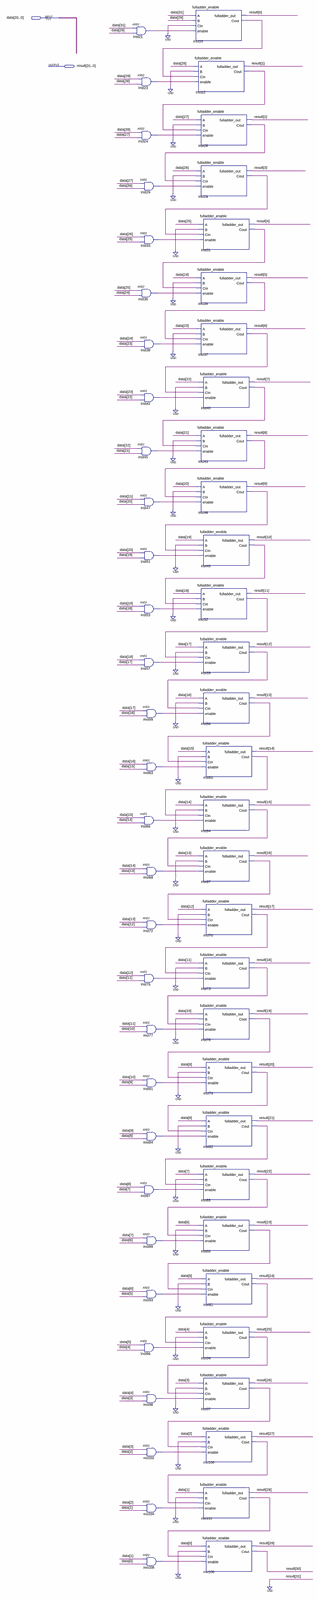
[diagram p0: schematic sheet, whole]
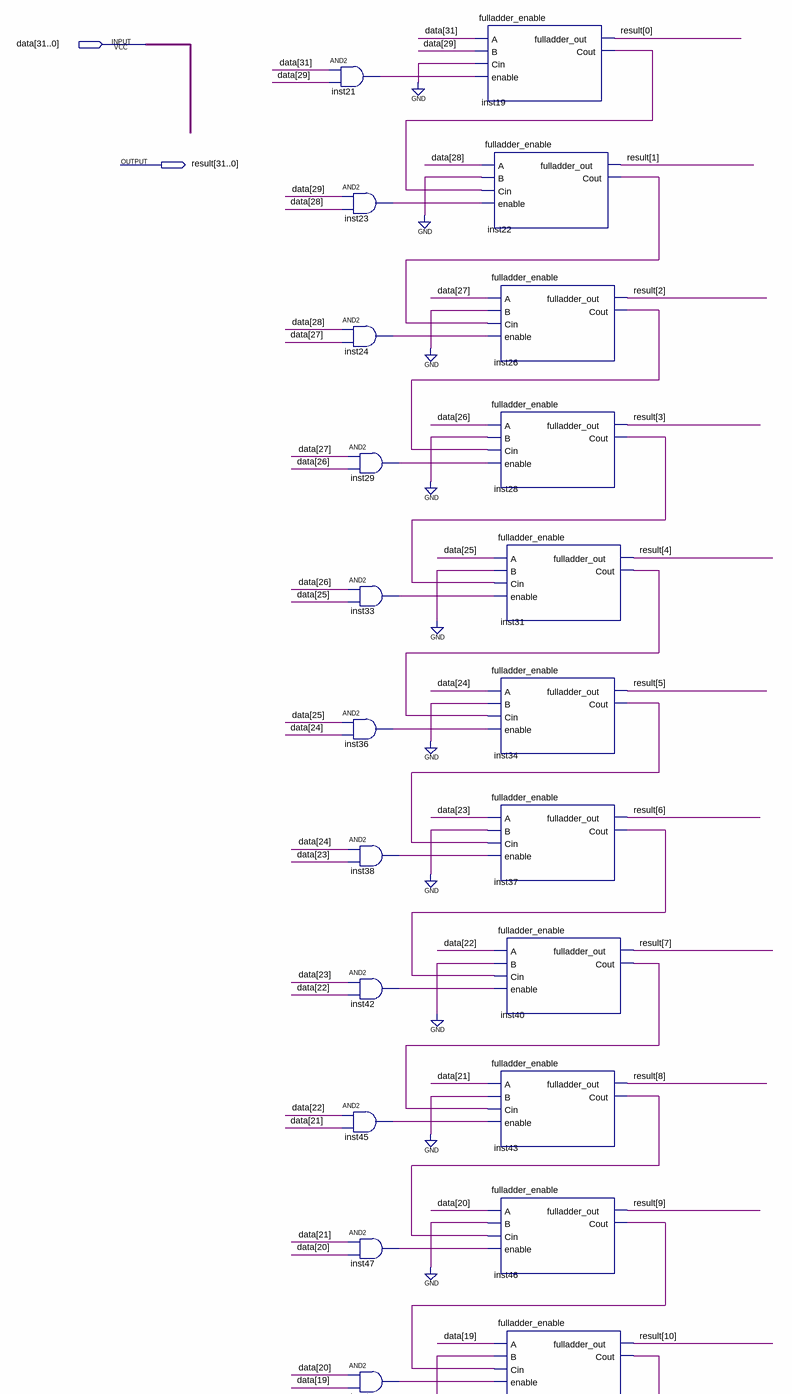
[diagram p1: schematic sheet, upper part]
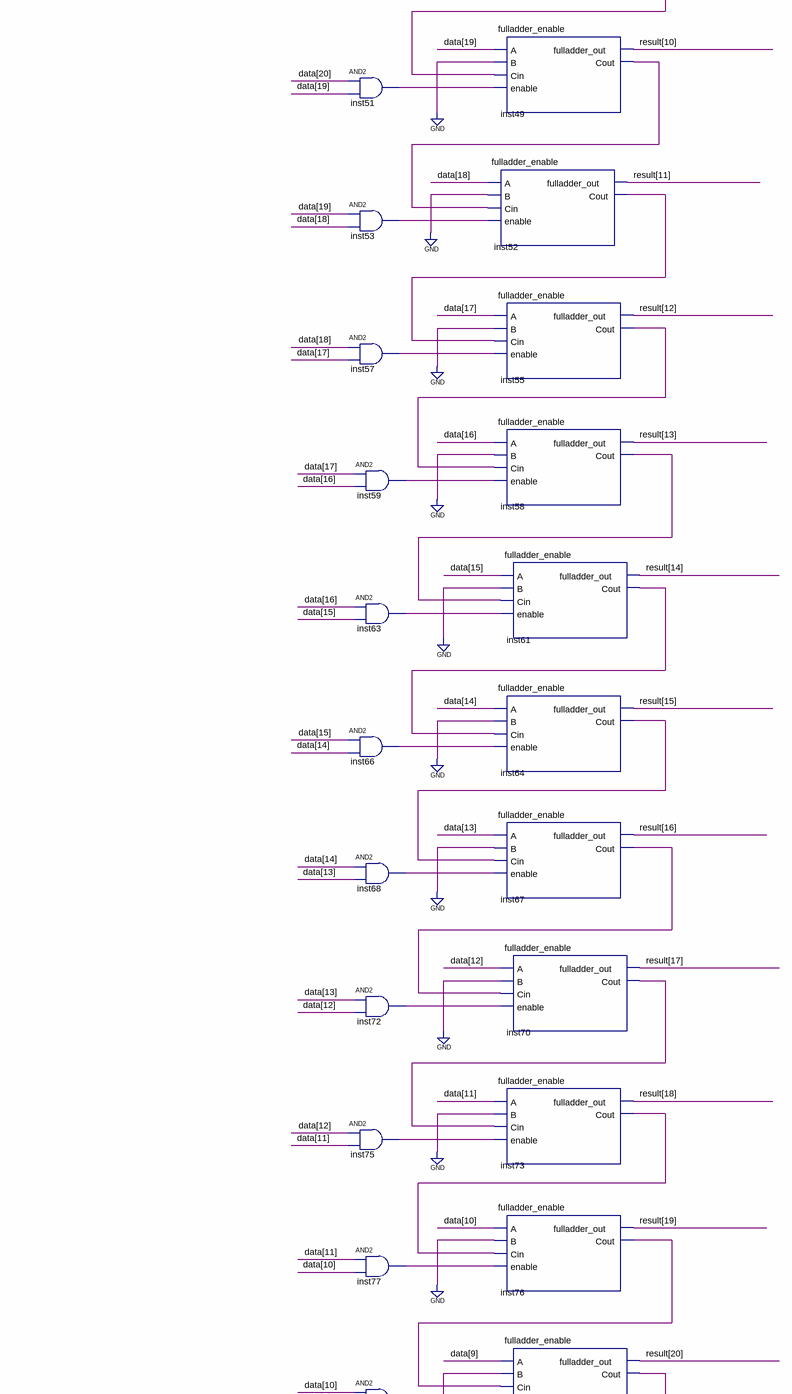
[diagram p2: schematic sheet, middle part]
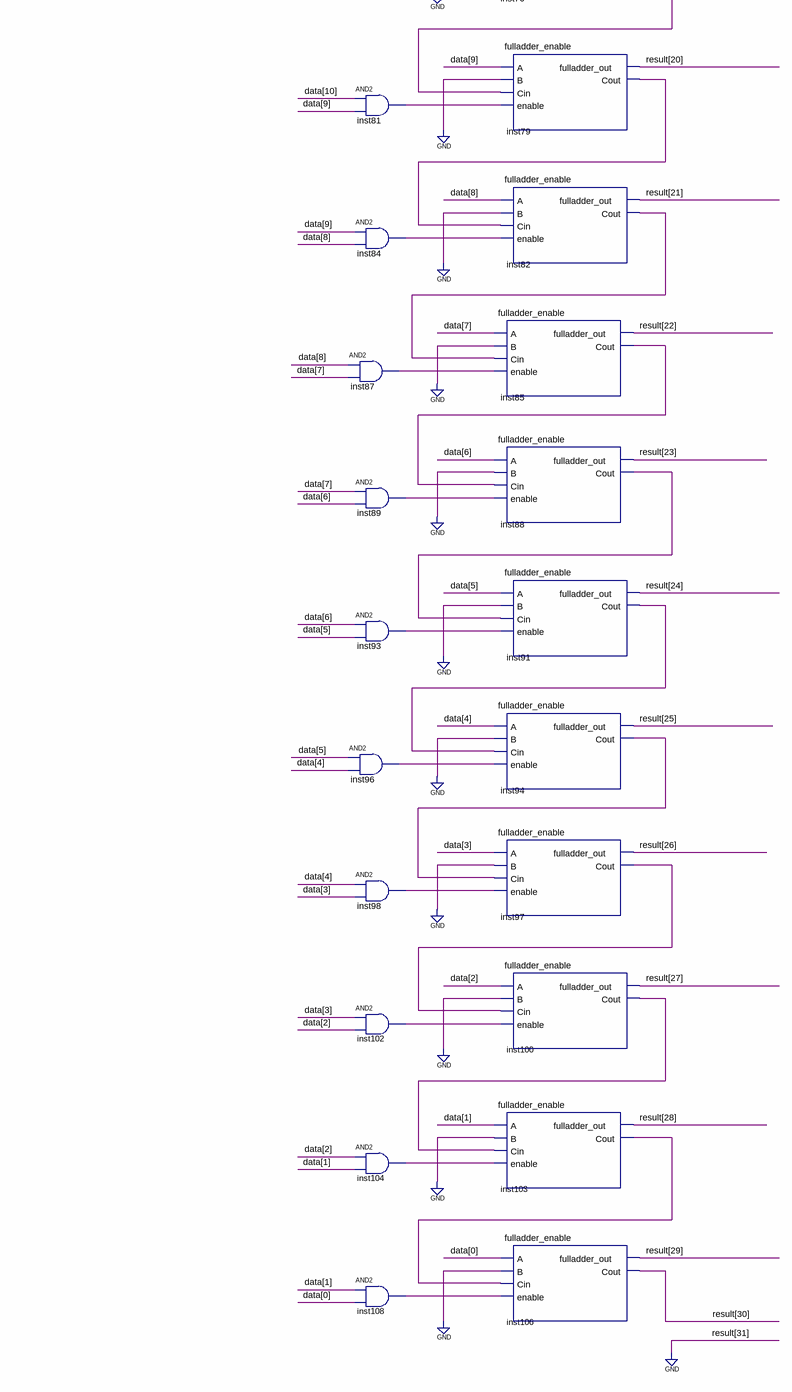
[diagram p3: schematic sheet, lower part]
// Quartus schematic clo_instruction.bdf as structural Verilog: 60 symbols, 2 pins
module clo_instruction (
  input  [31:0] data,
  output [31:0] result
);

  wire inst19_cout, inst21_out, inst22_cout, inst23_out, inst24_out, inst26_cout, inst28_cout, inst29_out,
       inst31_cout, inst33_out, inst34_cout, inst36_out, inst37_cout, inst38_out, inst40_cout, inst42_out,
       inst43_cout, inst45_out, inst46_cout, inst47_out, inst49_cout, inst51_out, inst52_cout, inst53_out,
       inst55_cout, inst57_out, inst58_cout, inst59_out, inst61_cout, inst63_out, inst64_cout, inst66_out,
       inst67_cout, inst68_out, inst70_cout, inst72_out, inst73_cout, inst75_out, inst76_cout, inst77_out,
       inst79_cout, inst81_out, inst82_cout, inst84_out, inst85_cout, inst87_out, inst88_cout, inst89_out,
       inst91_cout, inst93_out, inst94_cout, inst96_out, inst97_cout, inst98_out, inst100_cout, inst102_out,
       inst103_cout, inst104_out, inst108_out;

  and inst21 (inst21_out, data[31], data[29]);
  and inst23 (inst23_out, data[29], data[28]);
  and inst24 (inst24_out, data[28], data[27]);
  and inst29 (inst29_out, data[27], data[26]);
  and inst33 (inst33_out, data[26], data[25]);
  and inst36 (inst36_out, data[25], data[24]);
  and inst38 (inst38_out, data[24], data[23]);
  and inst42 (inst42_out, data[23], data[22]);
  and inst45 (inst45_out, data[22], data[21]);
  and inst47 (inst47_out, data[21], data[20]);
  and inst51 (inst51_out, data[20], data[19]);
  and inst53 (inst53_out, data[19], data[18]);
  and inst57 (inst57_out, data[18], data[17]);
  and inst59 (inst59_out, data[17], data[16]);
  and inst63 (inst63_out, data[16], data[15]);
  and inst66 (inst66_out, data[15], data[14]);
  and inst68 (inst68_out, data[14], data[13]);
  and inst72 (inst72_out, data[13], data[12]);
  and inst75 (inst75_out, data[12], data[11]);
  and inst77 (inst77_out, data[11], data[10]);
  and inst81 (inst81_out, data[10], data[9]);
  and inst84 (inst84_out, data[9], data[8]);
  and inst87 (inst87_out, data[8], data[7]);
  and inst89 (inst89_out, data[7], data[6]);
  and inst93 (inst93_out, data[6], data[5]);
  and inst96 (inst96_out, data[5], data[4]);
  and inst98 (inst98_out, data[4], data[3]);
  and inst102 (inst102_out, data[3], data[2]);
  and inst104 (inst104_out, data[2], data[1]);
  and inst108 (inst108_out, data[1], data[0]);
  fulladder_enable inst19 (
    .A(data[31]), .B(data[29]), .Cin(1'b0), .enable(inst21_out), .fulladder_out(result[0]), .Cout(inst19_cout));
  fulladder_enable inst22 (
    .A(data[28]), .B(1'b0), .Cin(inst19_cout), .enable(inst23_out), .fulladder_out(result[1]),
    .Cout(inst22_cout));
  fulladder_enable inst26 (
    .A(data[27]), .B(1'b0), .Cin(inst22_cout), .enable(inst24_out), .fulladder_out(result[2]),
    .Cout(inst26_cout));
  fulladder_enable inst28 (
    .A(data[26]), .B(1'b0), .Cin(inst26_cout), .enable(inst29_out), .fulladder_out(result[3]),
    .Cout(inst28_cout));
  fulladder_enable inst31 (
    .A(data[25]), .B(1'b0), .Cin(inst28_cout), .enable(inst33_out), .fulladder_out(result[4]),
    .Cout(inst31_cout));
  fulladder_enable inst34 (
    .A(data[24]), .B(1'b0), .Cin(inst31_cout), .enable(inst36_out), .fulladder_out(result[5]),
    .Cout(inst34_cout));
  fulladder_enable inst37 (
    .A(data[23]), .B(1'b0), .Cin(inst34_cout), .enable(inst38_out), .fulladder_out(result[6]),
    .Cout(inst37_cout));
  fulladder_enable inst40 (
    .A(data[22]), .B(1'b0), .Cin(inst37_cout), .enable(inst42_out), .fulladder_out(result[7]),
    .Cout(inst40_cout));
  fulladder_enable inst43 (
    .A(data[21]), .B(1'b0), .Cin(inst40_cout), .enable(inst45_out), .fulladder_out(result[8]),
    .Cout(inst43_cout));
  fulladder_enable inst46 (
    .A(data[20]), .B(1'b0), .Cin(inst43_cout), .enable(inst47_out), .fulladder_out(result[9]),
    .Cout(inst46_cout));
  fulladder_enable inst49 (
    .A(data[19]), .B(1'b0), .Cin(inst46_cout), .enable(inst51_out), .fulladder_out(result[10]),
    .Cout(inst49_cout));
  fulladder_enable inst52 (
    .A(data[18]), .B(1'b0), .Cin(inst49_cout), .enable(inst53_out), .fulladder_out(result[11]),
    .Cout(inst52_cout));
  fulladder_enable inst55 (
    .A(data[17]), .B(1'b0), .Cin(inst52_cout), .enable(inst57_out), .fulladder_out(result[12]),
    .Cout(inst55_cout));
  fulladder_enable inst58 (
    .A(data[16]), .B(1'b0), .Cin(inst55_cout), .enable(inst59_out), .fulladder_out(result[13]),
    .Cout(inst58_cout));
  fulladder_enable inst61 (
    .A(data[15]), .B(1'b0), .Cin(inst58_cout), .enable(inst63_out), .fulladder_out(result[14]),
    .Cout(inst61_cout));
  fulladder_enable inst64 (
    .A(data[14]), .B(1'b0), .Cin(inst61_cout), .enable(inst66_out), .fulladder_out(result[15]),
    .Cout(inst64_cout));
  fulladder_enable inst67 (
    .A(data[13]), .B(1'b0), .Cin(inst64_cout), .enable(inst68_out), .fulladder_out(result[16]),
    .Cout(inst67_cout));
  fulladder_enable inst70 (
    .A(data[12]), .B(1'b0), .Cin(inst67_cout), .enable(inst72_out), .fulladder_out(result[17]),
    .Cout(inst70_cout));
  fulladder_enable inst73 (
    .A(data[11]), .B(1'b0), .Cin(inst70_cout), .enable(inst75_out), .fulladder_out(result[18]),
    .Cout(inst73_cout));
  fulladder_enable inst76 (
    .A(data[10]), .B(1'b0), .Cin(inst73_cout), .enable(inst77_out), .fulladder_out(result[19]),
    .Cout(inst76_cout));
  fulladder_enable inst79 (
    .A(data[9]), .B(1'b0), .Cin(inst76_cout), .enable(inst81_out), .fulladder_out(result[20]),
    .Cout(inst79_cout));
  fulladder_enable inst82 (
    .A(data[8]), .B(1'b0), .Cin(inst79_cout), .enable(inst84_out), .fulladder_out(result[21]),
    .Cout(inst82_cout));
  fulladder_enable inst85 (
    .A(data[7]), .B(1'b0), .Cin(inst82_cout), .enable(inst87_out), .fulladder_out(result[22]),
    .Cout(inst85_cout));
  fulladder_enable inst88 (
    .A(data[6]), .B(1'b0), .Cin(inst85_cout), .enable(inst89_out), .fulladder_out(result[23]),
    .Cout(inst88_cout));
  fulladder_enable inst91 (
    .A(data[5]), .B(1'b0), .Cin(inst88_cout), .enable(inst93_out), .fulladder_out(result[24]),
    .Cout(inst91_cout));
  fulladder_enable inst94 (
    .A(data[4]), .B(1'b0), .Cin(inst91_cout), .enable(inst96_out), .fulladder_out(result[25]),
    .Cout(inst94_cout));
  fulladder_enable inst97 (
    .A(data[3]), .B(1'b0), .Cin(inst94_cout), .enable(inst98_out), .fulladder_out(result[26]),
    .Cout(inst97_cout));
  fulladder_enable inst100 (
    .A(data[2]), .B(1'b0), .Cin(inst97_cout), .enable(inst102_out), .fulladder_out(result[27]),
    .Cout(inst100_cout));
  fulladder_enable inst103 (
    .A(data[1]), .B(1'b0), .Cin(inst100_cout), .enable(inst104_out), .fulladder_out(result[28]),
    .Cout(inst103_cout));
  fulladder_enable inst106 (
    .A(data[0]), .B(1'b0), .Cin(inst103_cout), .enable(inst108_out), .fulladder_out(result[29]),
    .Cout(result[30]));

  assign result[31] = 1'b0;
endmodule
